# Altium project RK3576-SMC (021.0 A0).PrjPCB (part 1 of 3)
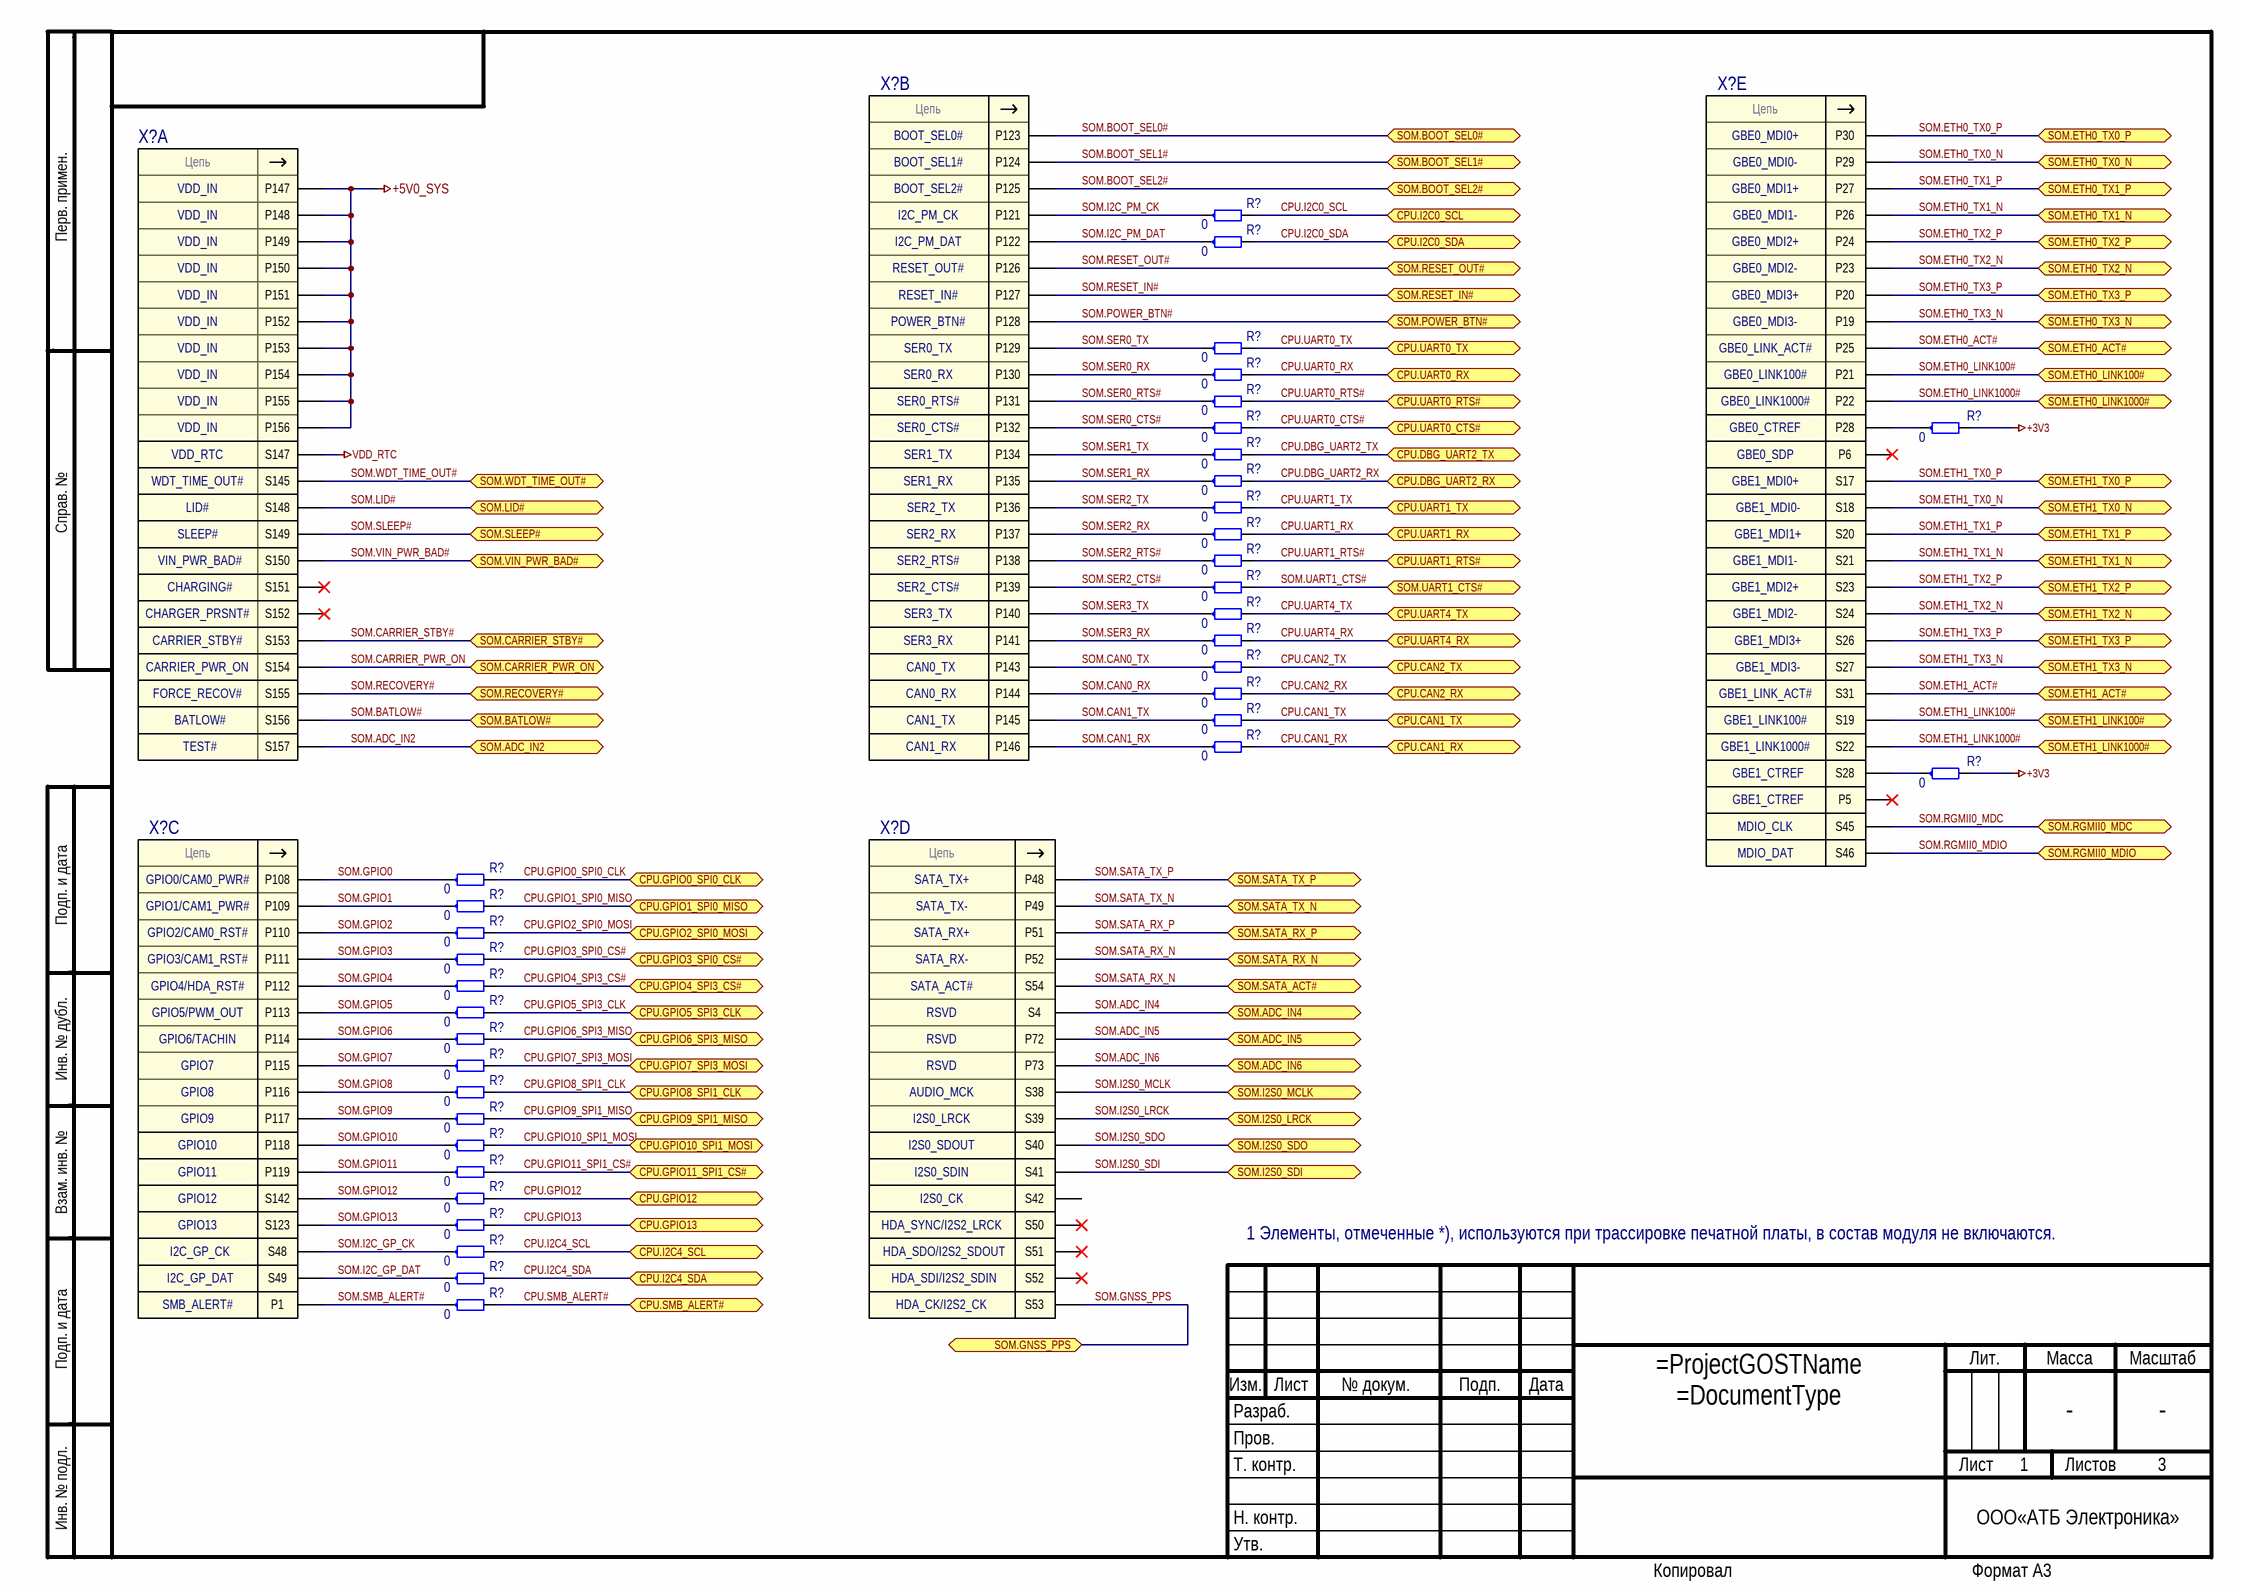
[diagram p0: RK3576-SMC.SMARC_1 (0021.0 A0).SchDoc]
ProjectGOSTOrganization: «АТБ Электроника»; ProjectGOSTPCBName: Плата печатная; ProjectGOSTPCBNumber: АНПБ.687264.019; ProjectGOSTPCBWeight: 30 г; ProjectRevisionCode: C1
7 sheets, 254 parts. Net scope: flat (ports and power ports of the same name join across sheets).
Board file: RK3576-SMC (0021.0 A0).PcbDoc
Sheets:
  RK3576-SMC.SMARC_1 (0021.0 A0).SchDoc
  RK3576-SMC.SMARC_2 (0021.0 A0).SchDoc
  RK3576-SMC.SMARC_3 (0021.0 A0).SchDoc
  RK3576-SMC.PMIC_BUCK (0021.0 A0).SchDoc
  RK3576-SMC.PMIC_LDO (0021.0 A0).SchDoc
  RK3576-SMC.LPDDR4 (0021.0 A0).SchDoc
  RK3576-SMC.EMMC (0021.0 A0).SchDoc

## Sheet RK3576-SMC.SMARC_1 (0021.0 A0).SchDoc
size 420 x 297 mm; SheetNumber: 1; SheetTotal: 3; Scale: -; DocumentType: Схема электрическая принципиальная; DocumentGOSTLIt1: ㅤ; DocumentGOSTLIt2: ㅤ; DocumentGOSTLIt3: ㅤ; DocumentTypeShort: Э3; DocumentGOSTNote: 1 Элементы, отмеченные *), используются при трассировке печатной платы, в состав модуля не включаются.; DocumentInvertoryNumber: ㅤ

### Parts
(Parts that share a designator on the sheet are numbered #1, #2 ... from top to bottom, then left to right.)
R?#1  0  [resc0603x26n]
R?#2  0  [resc0603x26n]
R?#3  0  [resc0603x26n]
R?#4  0  [resc0603x26n]
R?#5  0  [resc0603x26n]
R?#6  0  [resc0603x26n]
R?#7  0  [resc0603x26n]
R?#8  0  [resc0603x26n]
R?#9  0  [resc0603x26n]
R?#10  0  [resc0603x26n]
R?#11  0  [resc0603x26n]
R?#12  0  [resc0603x26n]
R?#13  0  [resc0603x26n]
R?#14  0  [resc0603x26n]
R?#15  0  [resc0603x26n]
R?#16  0  [resc0603x26n]
R?#17  0  [resc0603x26n]
R?#18  0  [resc0603x26n]
R?#19  0  [resc0603x26n]
R?#20  0  [resc0603x26n]
R?#21  0  [resc0603x26n]
R?#22  0  [resc0603x26n]
R?#23  0  [resc0603x26n]
R?#24  0  [resc0603x26n]
R?#25  0  [resc0603x26n]
R?#26  0  [resc0603x26n]
R?#27  0  [resc0603x26n]
R?#28  0  [resc0603x26n]
R?#29  0  [resc0603x26n]
R?#30  0  [resc0603x26n]
R?#31  0  [resc0603x26n]
R?#32  0  [resc0603x26n]
R?#33  0  [resc0603x26n]
R?#34  0  [resc0603x26n]
R?#35  0  [resc0603x26n]
R?#36  0  [resc0603x26n]
R?#37  0  [resc0603x26n]
X?#1  SMARC  [con_smarc]  (value not drawn)  (part B of 13)
X?#2  SMARC  [con_smarc]  (value not drawn)  (part E of 13)
X?#3  SMARC  [con_smarc]  (value not drawn)  (part A of 13)
X?#4  SMARC  [con_smarc]  (value not drawn)  (part C of 13)
X?#5  SMARC  [con_smarc]  (value not drawn)  (part D of 13)

### Ports
CPU.CAN1_RX (bidir), CPU.CAN1_TX (bidir), CPU.CAN2_RX (bidir), CPU.CAN2_TX (bidir), CPU.DBG_UART2_RX (bidir), CPU.DBG_UART2_TX (bidir), CPU.GPIO0_SPI0_CLK (bidir), CPU.GPIO1_SPI0_MISO (bidir), CPU.GPIO2_SPI0_MOSI (bidir), CPU.GPIO3_SPI0_CS# (bidir), CPU.GPIO4_SPI3_CS# (bidir), CPU.GPIO5_SPI3_CLK (bidir), CPU.GPIO6_SPI3_MISO (bidir), CPU.GPIO7_SPI3_MOSI (bidir), CPU.GPIO8_SPI1_CLK (bidir), CPU.GPIO9_SPI1_MISO (bidir), CPU.GPIO10_SPI1_MOSI (bidir), CPU.GPIO11_SPI1_CS# (bidir), CPU.GPIO12 (bidir), CPU.GPIO13 (bidir), CPU.I2C0_SCL (bidir), CPU.I2C0_SDA (bidir), CPU.I2C4_SCL (bidir), CPU.I2C4_SDA (bidir), CPU.SMB_ALERT# (bidir), CPU.UART0_CTS# (bidir), CPU.UART0_RTS# (bidir), CPU.UART0_RX (bidir), CPU.UART0_TX (bidir), CPU.UART1_RTS# (bidir), CPU.UART1_RX (bidir), CPU.UART1_TX (bidir), CPU.UART4_RX (bidir), CPU.UART4_TX (bidir), SOM.ADC_IN2 (bidir), SOM.ADC_IN4 (bidir), SOM.ADC_IN5 (bidir), SOM.ADC_IN6 (bidir), SOM.BATLOW# (bidir), SOM.BOOT_SEL0# (bidir), SOM.BOOT_SEL1# (bidir), SOM.BOOT_SEL2# (bidir), SOM.CARRIER_PWR_ON (bidir), SOM.CARRIER_STBY# (bidir), SOM.ETH0_ACT# (bidir), SOM.ETH0_LINK100# (bidir), SOM.ETH0_LINK1000# (bidir), SOM.ETH0_TX0_N (bidir), SOM.ETH0_TX0_P (bidir), SOM.ETH0_TX1_N (bidir), SOM.ETH0_TX1_P (bidir), SOM.ETH0_TX2_N (bidir), SOM.ETH0_TX2_P (bidir), SOM.ETH0_TX3_N (bidir), SOM.ETH0_TX3_P (bidir), SOM.ETH1_ACT# (bidir), SOM.ETH1_LINK100# (bidir), SOM.ETH1_LINK1000# (bidir), SOM.ETH1_TX0_N (bidir), SOM.ETH1_TX0_P (bidir), SOM.ETH1_TX1_N (bidir), SOM.ETH1_TX1_P (bidir), SOM.ETH1_TX2_N (bidir), SOM.ETH1_TX2_P (bidir), SOM.ETH1_TX3_N (bidir), SOM.ETH1_TX3_P (bidir), SOM.GNSS_PPS (bidir), SOM.I2S0_LRCK (bidir), SOM.I2S0_MCLK (bidir), SOM.I2S0_SDI (bidir), SOM.I2S0_SDO (bidir), SOM.LID# (bidir), SOM.POWER_BTN# (bidir), SOM.RECOVERY# (bidir), SOM.RESET_IN# (bidir), SOM.RESET_OUT# (bidir), SOM.RGMII0_MDC (bidir), SOM.RGMII0_MDIO (bidir), SOM.SATA_ACT# (bidir), SOM.SATA_RX_N (bidir), SOM.SATA_RX_P (bidir), SOM.SATA_TX_N (bidir), SOM.SATA_TX_P (bidir), SOM.SLEEP# (bidir), SOM.UART1_CTS# (bidir), SOM.VIN_PWR_BAD# (bidir), SOM.WDT_TIME_OUT# (bidir)

### Nets
+3V3: R?#7.2 R?#20.2
+5V0_SYS: X?#3.P147 X?#3.P148 X?#3.P149 X?#3.P150 X?#3.P151 X?#3.P152 X?#3.P153 X?#3.P154 X?#3.P155 X?#3.P156
VDD_RTC: X?#3.S147
CPU.CAN1_RX: R?#19.2 ; port CPU.CAN1_RX
CPU.CAN1_TX: R?#18.2 ; port CPU.CAN1_TX
CPU.CAN2_RX: R?#17.2 ; port CPU.CAN2_RX
CPU.CAN2_TX: R?#16.2 ; port CPU.CAN2_TX
CPU.DBG_UART2_RX: R?#9.2 ; port CPU.DBG_UART2_RX
CPU.DBG_UART2_TX: R?#8.2 ; port CPU.DBG_UART2_TX
CPU.GPIO0_SPI0_CLK: R?#21.2 ; port CPU.GPIO0_SPI0_CLK
CPU.GPIO1_SPI0_MISO: R?#22.2 ; port CPU.GPIO1_SPI0_MISO
CPU.GPIO2_SPI0_MOSI: R?#23.2 ; port CPU.GPIO2_SPI0_MOSI
CPU.GPIO3_SPI0_CS#: R?#24.2 ; port CPU.GPIO3_SPI0_CS#
CPU.GPIO4_SPI3_CS#: R?#25.2 ; port CPU.GPIO4_SPI3_CS#
CPU.GPIO5_SPI3_CLK: R?#26.2 ; port CPU.GPIO5_SPI3_CLK
CPU.GPIO6_SPI3_MISO: R?#27.2 ; port CPU.GPIO6_SPI3_MISO
CPU.GPIO7_SPI3_MOSI: R?#28.2 ; port CPU.GPIO7_SPI3_MOSI
CPU.GPIO8_SPI1_CLK: R?#29.2 ; port CPU.GPIO8_SPI1_CLK
CPU.GPIO9_SPI1_MISO: R?#30.2 ; port CPU.GPIO9_SPI1_MISO
CPU.GPIO10_SPI1_MOSI: R?#31.2 ; port CPU.GPIO10_SPI1_MOSI
CPU.GPIO11_SPI1_CS#: R?#32.2 ; port CPU.GPIO11_SPI1_CS#
CPU.GPIO12: R?#33.2 ; port CPU.GPIO12
CPU.GPIO13: R?#34.2 ; port CPU.GPIO13
CPU.I2C0_SCL: R?#1.2 ; port CPU.I2C0_SCL
CPU.I2C0_SDA: R?#2.2 ; port CPU.I2C0_SDA
CPU.I2C4_SCL: R?#35.2 ; port CPU.I2C4_SCL
CPU.I2C4_SDA: R?#36.2 ; port CPU.I2C4_SDA
CPU.SMB_ALERT#: R?#37.2 ; port CPU.SMB_ALERT#
CPU.UART0_CTS#: R?#6.2 ; port CPU.UART0_CTS#
CPU.UART0_RTS#: R?#5.2 ; port CPU.UART0_RTS#
CPU.UART0_RX: R?#4.2 ; port CPU.UART0_RX
CPU.UART0_TX: R?#3.2 ; port CPU.UART0_TX
CPU.UART1_RTS#: R?#12.2 ; port CPU.UART1_RTS#
CPU.UART1_RX: R?#11.2 ; port CPU.UART1_RX
CPU.UART1_TX: R?#10.2 ; port CPU.UART1_TX
CPU.UART4_RX: R?#15.2 ; port CPU.UART4_RX
CPU.UART4_TX: R?#14.2 ; port CPU.UART4_TX
SOM.ADC_IN2: X?#3.S157 ; port SOM.ADC_IN2
SOM.ADC_IN4: X?#5.S4 ; port SOM.ADC_IN4
SOM.ADC_IN5: X?#5.P72 ; port SOM.ADC_IN5
SOM.ADC_IN6: X?#5.P73 ; port SOM.ADC_IN6
SOM.BATLOW#: X?#3.S156 ; port SOM.BATLOW#
SOM.BOOT_SEL0#: X?#1.P123 ; port SOM.BOOT_SEL0#
SOM.BOOT_SEL1#: X?#1.P124 ; port SOM.BOOT_SEL1#
SOM.BOOT_SEL2#: X?#1.P125 ; port SOM.BOOT_SEL2#
SOM.CAN0_RX: R?#17.1 X?#1.P144
SOM.CAN0_TX: R?#16.1 X?#1.P143
SOM.CAN1_RX: R?#19.1 X?#1.P146
SOM.CAN1_TX: R?#18.1 X?#1.P145
SOM.CARRIER_PWR_ON: X?#3.S154 ; port SOM.CARRIER_PWR_ON
SOM.CARRIER_STBY#: X?#3.S153 ; port SOM.CARRIER_STBY#
SOM.ETH0_ACT#: X?#2.P25 ; port SOM.ETH0_ACT#
SOM.ETH0_LINK100#: X?#2.P21 ; port SOM.ETH0_LINK100#
SOM.ETH0_LINK1000#: X?#2.P22 ; port SOM.ETH0_LINK1000#
SOM.ETH0_TX0_N: X?#2.P29 ; port SOM.ETH0_TX0_N
SOM.ETH0_TX0_P: X?#2.P30 ; port SOM.ETH0_TX0_P
SOM.ETH0_TX1_N: X?#2.P26 ; port SOM.ETH0_TX1_N
SOM.ETH0_TX1_P: X?#2.P27 ; port SOM.ETH0_TX1_P
SOM.ETH0_TX2_N: X?#2.P23 ; port SOM.ETH0_TX2_N
SOM.ETH0_TX2_P: X?#2.P24 ; port SOM.ETH0_TX2_P
SOM.ETH0_TX3_N: X?#2.P19 ; port SOM.ETH0_TX3_N
SOM.ETH0_TX3_P: X?#2.P20 ; port SOM.ETH0_TX3_P
SOM.ETH1_ACT#: X?#2.S31 ; port SOM.ETH1_ACT#
SOM.ETH1_LINK100#: X?#2.S19 ; port SOM.ETH1_LINK100#
SOM.ETH1_LINK1000#: X?#2.S22 ; port SOM.ETH1_LINK1000#
SOM.ETH1_TX0_N: X?#2.S18 ; port SOM.ETH1_TX0_N
SOM.ETH1_TX0_P: X?#2.S17 ; port SOM.ETH1_TX0_P
SOM.ETH1_TX1_N: X?#2.S21 ; port SOM.ETH1_TX1_N
SOM.ETH1_TX1_P: X?#2.S20 ; port SOM.ETH1_TX1_P
SOM.ETH1_TX2_N: X?#2.S24 ; port SOM.ETH1_TX2_N
SOM.ETH1_TX2_P: X?#2.S23 ; port SOM.ETH1_TX2_P
SOM.ETH1_TX3_N: X?#2.S27 ; port SOM.ETH1_TX3_N
SOM.ETH1_TX3_P: X?#2.S26 ; port SOM.ETH1_TX3_P
SOM.GNSS_PPS: X?#5.S53 ; port SOM.GNSS_PPS
SOM.GPIO0: R?#21.1 X?#4.P108
SOM.GPIO1: R?#22.1 X?#4.P109
SOM.GPIO2: R?#23.1 X?#4.P110
SOM.GPIO3: R?#24.1 X?#4.P111
SOM.GPIO4: R?#25.1 X?#4.P112
SOM.GPIO5: R?#26.1 X?#4.P113
SOM.GPIO6: R?#27.1 X?#4.P114
SOM.GPIO7: R?#28.1 X?#4.P115
SOM.GPIO8: R?#29.1 X?#4.P116
SOM.GPIO9: R?#30.1 X?#4.P117
SOM.GPIO10: R?#31.1 X?#4.P118
SOM.GPIO11: R?#32.1 X?#4.P119
SOM.GPIO12: R?#33.1 X?#4.S142
SOM.GPIO13: R?#34.1 X?#4.S123
SOM.I2C_GP_CK: R?#35.1 X?#4.S48
SOM.I2C_GP_DAT: R?#36.1 X?#4.S49
SOM.I2C_PM_CK: R?#1.1 X?#1.P121
SOM.I2C_PM_DAT: R?#2.1 X?#1.P122
SOM.I2S0_LRCK: X?#5.S39 ; port SOM.I2S0_LRCK
SOM.I2S0_MCLK: X?#5.S38 ; port SOM.I2S0_MCLK
SOM.I2S0_SDI: X?#5.S41 ; port SOM.I2S0_SDI
SOM.I2S0_SDO: X?#5.S40 ; port SOM.I2S0_SDO
SOM.LID#: X?#3.S148 ; port SOM.LID#
SOM.POWER_BTN#: X?#1.P128 ; port SOM.POWER_BTN#
SOM.RECOVERY#: X?#3.S155 ; port SOM.RECOVERY#
SOM.RESET_IN#: X?#1.P127 ; port SOM.RESET_IN#
SOM.RESET_OUT#: X?#1.P126 ; port SOM.RESET_OUT#
SOM.RGMII0_MDC: X?#2.S45 ; port SOM.RGMII0_MDC
SOM.RGMII0_MDIO: X?#2.S46 ; port SOM.RGMII0_MDIO
SOM.SATA_RX_N: X?#5.P52 X?#5.S54 ; port SOM.SATA_RX_N, port SOM.SATA_ACT#
SOM.SATA_RX_P: X?#5.P51 ; port SOM.SATA_RX_P
SOM.SATA_TX_N: X?#5.P49 ; port SOM.SATA_TX_N
SOM.SATA_TX_P: X?#5.P48 ; port SOM.SATA_TX_P
SOM.SER0_CTS#: R?#6.1 X?#1.P132
SOM.SER0_RTS#: R?#5.1 X?#1.P131
SOM.SER0_RX: R?#4.1 X?#1.P130
SOM.SER0_TX: R?#3.1 X?#1.P129
SOM.SER1_RX: R?#9.1 X?#1.P135
SOM.SER1_TX: R?#8.1 X?#1.P134
SOM.SER2_CTS#: R?#13.1 X?#1.P139
SOM.SER2_RTS#: R?#12.1 X?#1.P138
SOM.SER2_RX: R?#11.1 X?#1.P137
SOM.SER2_TX: R?#10.1 X?#1.P136
SOM.SER3_RX: R?#15.1 X?#1.P141
SOM.SER3_TX: R?#14.1 X?#1.P140
SOM.SLEEP#: X?#3.S149 ; port SOM.SLEEP#
SOM.SMB_ALERT#: R?#37.1 X?#4.P1
SOM.UART1_CTS#: R?#13.2 ; port SOM.UART1_CTS#
SOM.VIN_PWR_BAD#: X?#3.S150 ; port SOM.VIN_PWR_BAD#
SOM.WDT_TIME_OUT#: X?#3.S145 ; port SOM.WDT_TIME_OUT#
NetR?#7_1: R?#7.1 X?#2.P28
NetR?#20_1: R?#20.1 X?#2.S28

Not connected (* = marked no-connect by the designer): X?#2 P5* P6*; X?#3 S151* S152*; X?#5 S42 S50* S51* S52*

### Notes on the sheet
- Перв. примен.
- Справ. №
- Подп. и дата
- Инв. № дубл.
- Взам. инв. №
- Разраб.
- Изм.
- Лист
- № докум.
- Подп.
- Дата
- Лит.
- Масса
- Масштаб
- Пров.
- Т. контр.
- -
- Листов
- Инв. № подл.
- Утв.
- Н. контр.
- Копировал
- Формат А3
- (in symbol SMARC, part A) Цепь; VDD_IN; VDD_RTC; WDT_TIME_OUT#; LID#; SLEEP#; VIN_PWR_BAD#; CHARGING#; CHARGER_PRSNT#; CARRIER_STBY#; CARRIER_PWR_ON; FORCE_RECOV#; BATLOW#; TEST#
- (in symbol SMARC, part B) Цепь; BOOT_SEL0#; BOOT_SEL1#; BOOT_SEL2#; I2C_PM_CK; I2C_PM_DAT; RESET_OUT#; RESET_IN#; POWER_BTN#; SER0_TX; SER0_RX; SER0_RTS#; SER0_CTS#; SER1_TX; SER1_RX; SER2_TX; SER2_RX; SER2_RTS#; SER2_CTS#; SER3_TX; SER3_RX; CAN0_TX; CAN0_RX; CAN1_TX; CAN1_RX
- (in symbol SMARC, part C) Цепь; GPIO0/CAM0_PWR#; GPIO1/CAM1_PWR#; GPIO2/CAM0_RST#; GPIO3/CAM1_RST#; GPIO4/HDA_RST#; GPIO5/PWM_OUT; GPIO6/TACHIN; GPIO7; GPIO8; GPIO9; GPIO10; GPIO11; GPIO12; GPIO13; I2C_GP_CK; I2C_GP_DAT; SMB_ALERT#
- (in symbol SMARC, part D) Цепь; SATA_TX+; SATA_TX-; SATA_RX+; SATA_RX-; SATA_ACT#; RSVD; AUDIO_MCK; I2S0_LRCK; I2S0_SDOUT; I2S0_SDIN; I2S0_CK; HDA_SYNC/I2S2_LRCK; HDA_SDO/I2S2_SDOUT; HDA_SDI/I2S2_SDIN; HDA_CK/I2S2_CK
- (in symbol SMARC, part E) Цепь; GBE0_MDI0+; GBE0_MDI0-; GBE0_MDI1+; GBE0_MDI1-; GBE0_MDI2+; GBE0_MDI2-; GBE0_MDI3+; GBE0_MDI3-; GBE0_LINK_ACT#; GBE0_LINK100#; GBE0_LINK1000#; GBE0_CTREF; GBE0_SDP; GBE1_MDI0+; GBE1_MDI0-; GBE1_MDI1+; GBE1_MDI1-; GBE1_MDI2+; GBE1_MDI2-; GBE1_MDI3+; GBE1_MDI3-; GBE1_LINK_ACT#; GBE1_LINK100#; GBE1_LINK1000#; GBE1_CTREF; MDIO_CLK; MDIO_DAT

### Library data of the parts
R?#1-R?#37 = RC0201JR-070RL: Резисторы (chip) общего назначения; Part_ID: ATB-09733; Manufacturer: Yageo; Schematic_Part: R_min_val,R_min,R_val,R; Наименование: 0201-0.05W-0±5%; Voltage: 30V; Power: 0.05; Точность: ±5%; Температура: -55 +125; Вариант установки: Поверхностный; Код ERP: E2-00008416; Photo: Photos\Photos\Yageo_RC0075-RC2512.jpg; Автор: Чепиков И.В.; Device: 0201-0.05W-0±5%_Yageo; Library Ref 2: R; Part Number: RC0201JR-070RL; Тип ЭКБ: Резисторы; Datasheet: Datasheets\Resistors\PYu-RC_Group_51_RoHS_L_12.pdf; Тип компонента: Резистор; Номинал: 0; Value: 0; Part_Number: RC0201JR-070RL; PCB_Footprint: resc0603x26n; Тип корпуса: Chip; Height: 0.26; Производитель: Yageo; Website: https://www.yageo.com/upload/media/product/products/datasheet/rchip/PYu-RC_Group_51_RoHS_L_12.pdf; Дата: 14.01.2025; NameFromManufacturer: RC0201JR-070RL; ComponentLink1URL: https://www.yageo.com/upload/media/product/products/datasheet/rchip/PYu-RC_Group_51_RoHS_L_12.pdf; ComponentLink1Description: PYu-RC_Group_51_RoHS_L_12.pdf; Original PN: RC0201JR-070RL
X?#1-X?#5 = SMARC: Краевой разъем SMARC_V21, 314 конт.; Part_ID: ATB-00378; Manufacturer: SMARC 2.1 Specification; Тип ЭКБ: Соединители; Тип компонента: Вилка Краевой Smarc; Photo: Photos\Photos\SMARC.jpg; Автор: Чепиков И.В.; Part Number: SMARC; Наименование: SMARC; Datasheet: Datasheets\Connectors\SMARC_V21-specification.pdf; Schematic_Part: SMARC_v2_1_XP; Value: SMARC; Part_Number: SMARC; PCB_Footprint: con_smarc; Website: https://www.isee.biz/images/Manuals/smarc/SMARC_Hardware_Specification_V211.pdf; Дата: 01.07.2024; Device: SMARC; NameFromManufacturer: SMARC; ComponentLink1URL: https://www.isee.biz/images/Manuals/smarc/SMARC_Hardware_Specification_V211.pdf; ComponentLink1Description: SMARC_V21-specification.pdf; Original PN: SMARC

## Sheet RK3576-SMC.SMARC_2 (0021.0 A0).SchDoc
size 420 x 297 mm; Scale: -; DocumentType: Схема электрическая принципиальная; DocumentGOSTLIt1: ㅤ; DocumentGOSTLIt2: ㅤ; DocumentGOSTLIt3: ㅤ; DocumentGOSTNote: Элементы, отмеченные *, используются при трассировке печатной платы, в состав модуля не включаются; SheetNumber: 2; SheetTotal: 6; DocumentTypeShort: Э3; DocumentInvertoryNumber: ㅤ
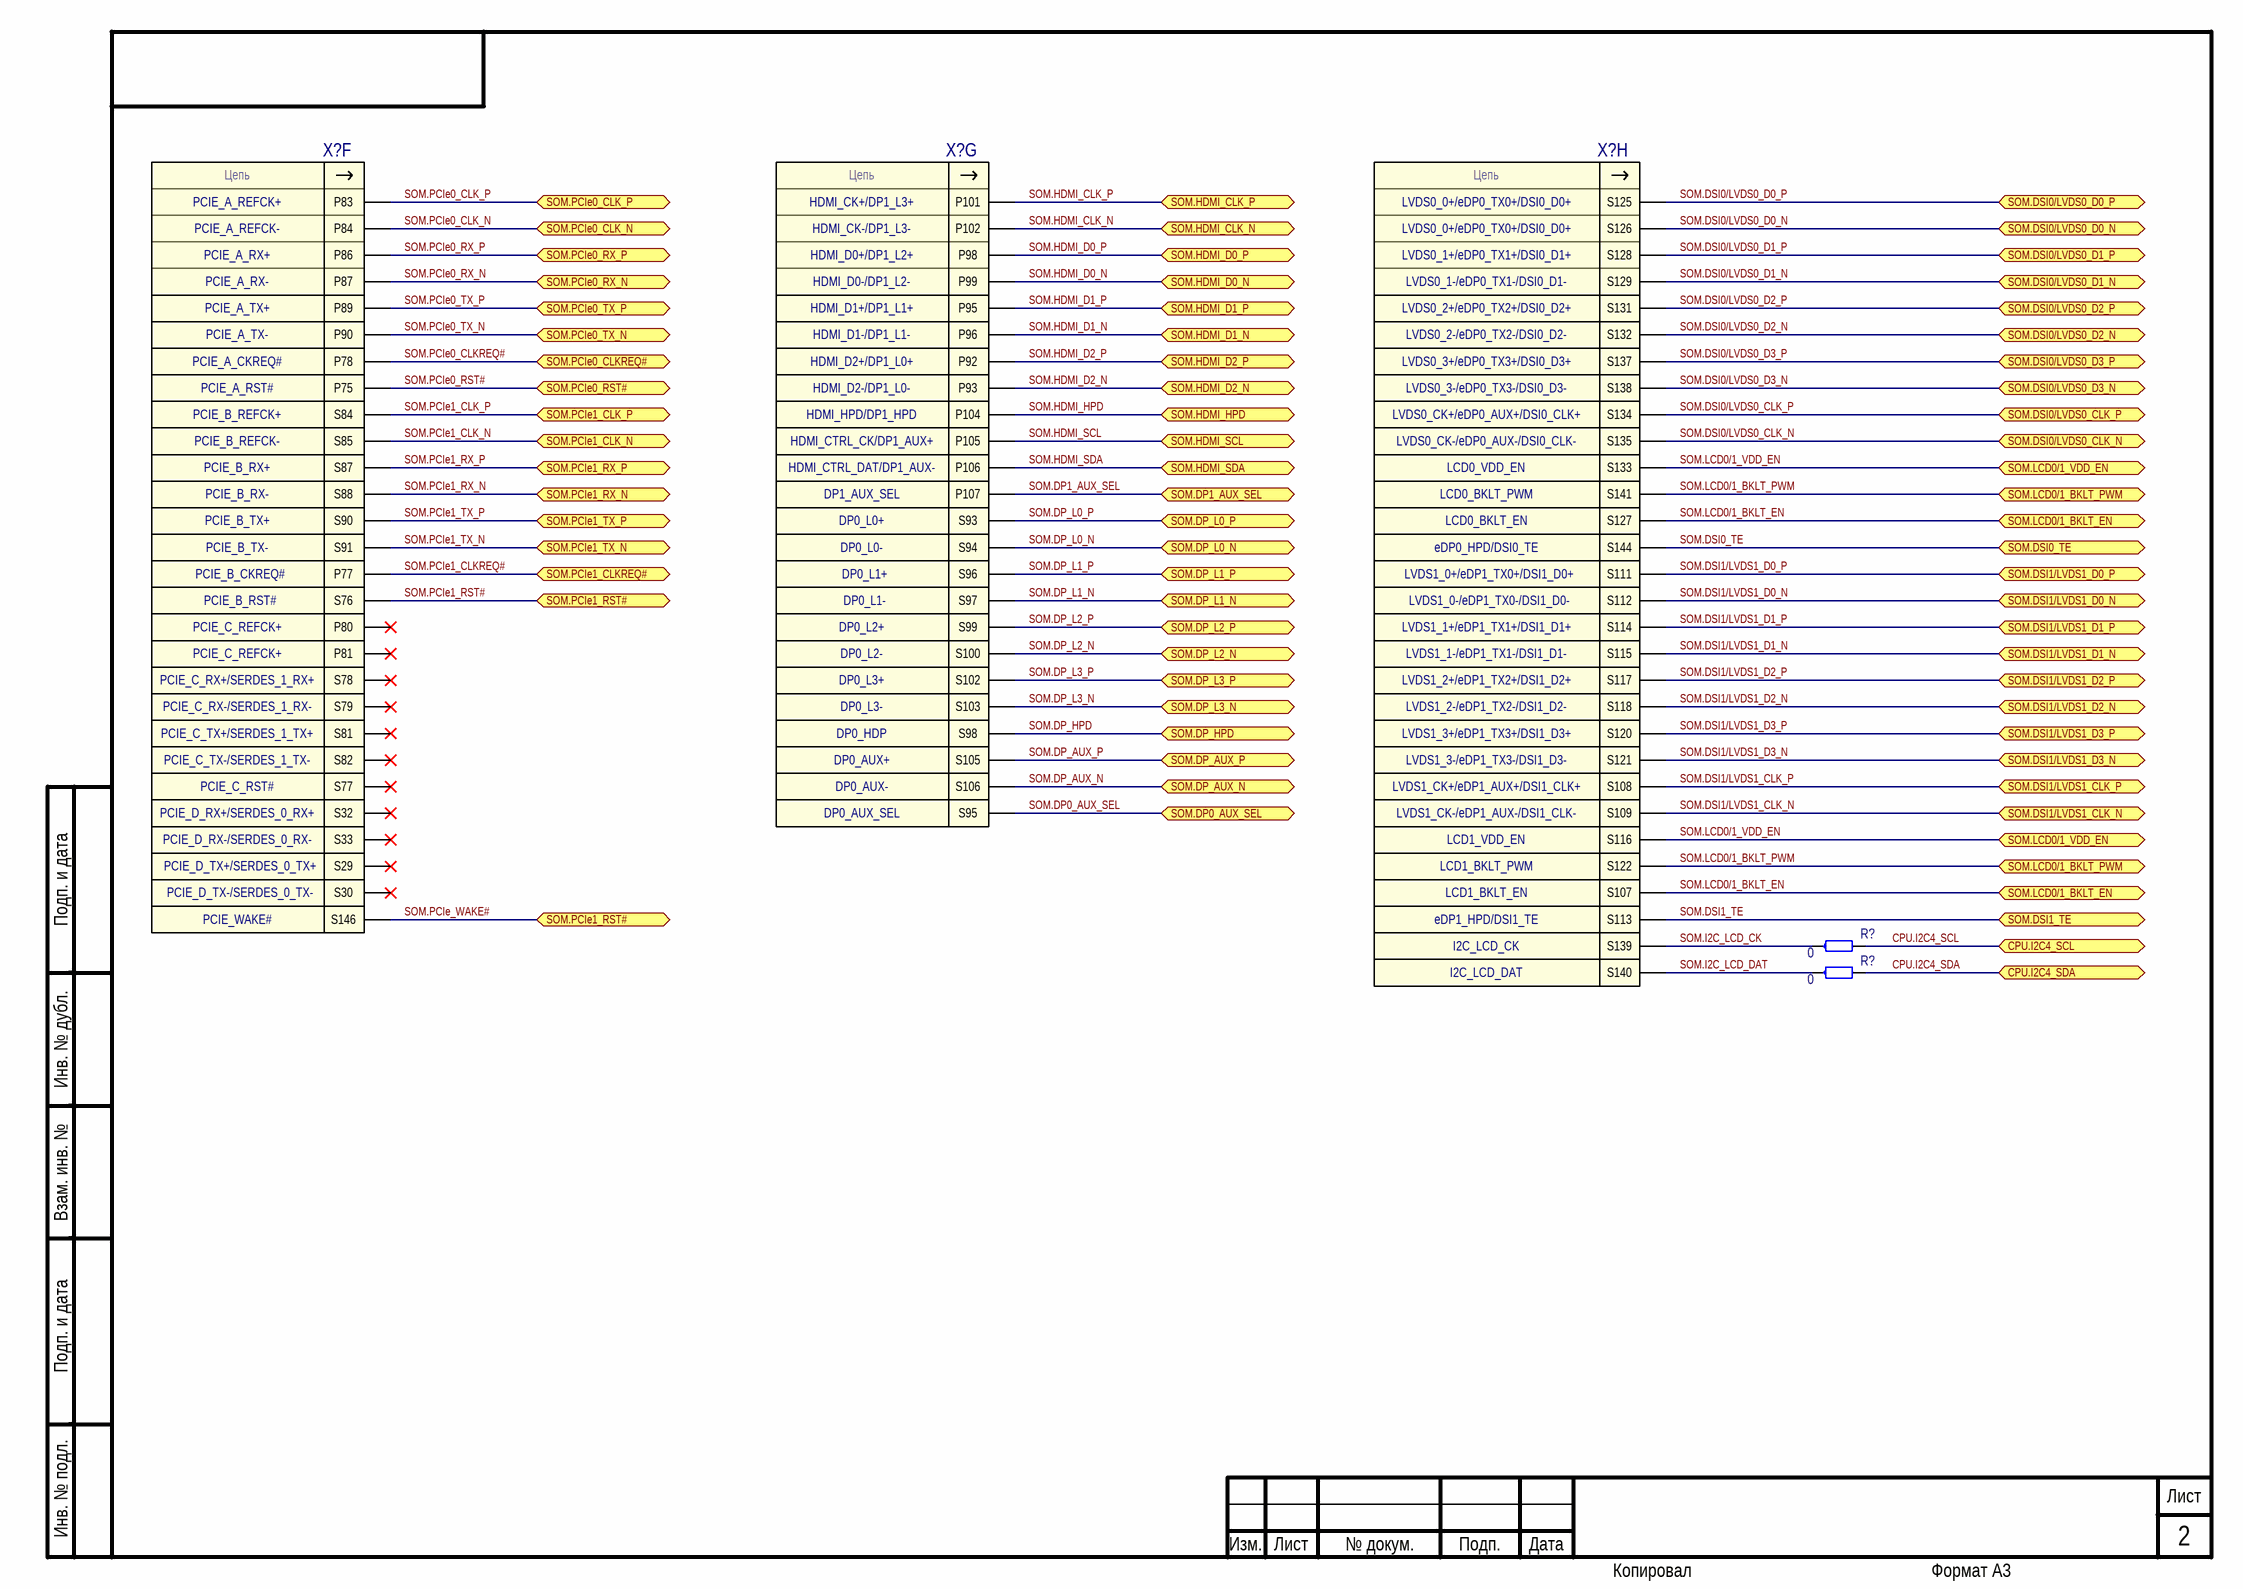
[diagram p1: RK3576-SMC.SMARC_2 (0021.0 A0).SchDoc]

### Parts
(Parts that share a designator on the sheet are numbered #1, #2 ... from top to bottom, then left to right.)
R?#38  0  [resc0603x26n]
R?#39  0  [resc0603x26n]
X?#6  SMARC  [con_smarc]  (value not drawn)  (part F of 13)
X?#7  SMARC  [con_smarc]  (value not drawn)  (part G of 13)
X?#8  SMARC  [con_smarc]  (value not drawn)  (part H of 13)

### Ports
CPU.I2C4_SCL (bidir), CPU.I2C4_SDA (bidir), SOM.DP0_AUX_SEL (bidir), SOM.DP1_AUX_SEL (bidir), SOM.DP_AUX_N (bidir), SOM.DP_AUX_P (bidir), SOM.DP_HPD (bidir), SOM.DP_L0_N (bidir), SOM.DP_L0_P (bidir), SOM.DP_L1_N (bidir), SOM.DP_L1_P (bidir), SOM.DP_L2_N (bidir), SOM.DP_L2_P (bidir), SOM.DP_L3_N (bidir), SOM.DP_L3_P (bidir), SOM.DSI0/LVDS0_CLK_N (bidir), SOM.DSI0/LVDS0_CLK_P (bidir), SOM.DSI0/LVDS0_D0_N (bidir), SOM.DSI0/LVDS0_D0_P (bidir), SOM.DSI0/LVDS0_D1_N (bidir), SOM.DSI0/LVDS0_D1_P (bidir), SOM.DSI0/LVDS0_D2_N (bidir), SOM.DSI0/LVDS0_D2_P (bidir), SOM.DSI0/LVDS0_D3_N (bidir), SOM.DSI0/LVDS0_D3_P (bidir), SOM.DSI0_TE (bidir), SOM.DSI1/LVDS1_CLK_N (bidir), SOM.DSI1/LVDS1_CLK_P (bidir), SOM.DSI1/LVDS1_D0_N (bidir), SOM.DSI1/LVDS1_D0_P (bidir), SOM.DSI1/LVDS1_D1_N (bidir), SOM.DSI1/LVDS1_D1_P (bidir), SOM.DSI1/LVDS1_D2_N (bidir), SOM.DSI1/LVDS1_D2_P (bidir), SOM.DSI1/LVDS1_D3_N (bidir), SOM.DSI1/LVDS1_D3_P (bidir), SOM.DSI1_TE (bidir), SOM.HDMI_CLK_N (bidir), SOM.HDMI_CLK_P (bidir), SOM.HDMI_D0_N (bidir), SOM.HDMI_D0_P (bidir), SOM.HDMI_D1_N (bidir), SOM.HDMI_D1_P (bidir), SOM.HDMI_D2_N (bidir), SOM.HDMI_D2_P (bidir), SOM.HDMI_HPD (bidir), SOM.HDMI_SCL (bidir), SOM.HDMI_SDA (bidir), SOM.LCD0/1_BKLT_EN (bidir), SOM.LCD0/1_BKLT_PWM (bidir), SOM.LCD0/1_VDD_EN (bidir), SOM.PCIe0_CLK_N (bidir), SOM.PCIe0_CLK_P (bidir), SOM.PCIe0_CLKREQ# (bidir), SOM.PCIe0_RST# (bidir), SOM.PCIe0_RX_N (bidir), SOM.PCIe0_RX_P (bidir), SOM.PCIe0_TX_N (bidir), SOM.PCIe0_TX_P (bidir), SOM.PCIe1_CLK_N (bidir), SOM.PCIe1_CLK_P (bidir), SOM.PCIe1_CLKREQ# (bidir), SOM.PCIe1_RST# (bidir), SOM.PCIe1_RX_N (bidir), SOM.PCIe1_RX_P (bidir), SOM.PCIe1_TX_N (bidir), SOM.PCIe1_TX_P (bidir)

### Nets
CPU.I2C4_SCL: R?#38.2 ; port CPU.I2C4_SCL
CPU.I2C4_SDA: R?#39.2 ; port CPU.I2C4_SDA
SOM.DP0_AUX_SEL: X?#7.S95 ; port SOM.DP0_AUX_SEL
SOM.DP1_AUX_SEL: X?#7.P107 ; port SOM.DP1_AUX_SEL
SOM.DP_AUX_N: X?#7.S106 ; port SOM.DP_AUX_N
SOM.DP_AUX_P: X?#7.S105 ; port SOM.DP_AUX_P
SOM.DP_HPD: X?#7.S98 ; port SOM.DP_HPD
SOM.DP_L0_N: X?#7.S94 ; port SOM.DP_L0_N
SOM.DP_L0_P: X?#7.S93 ; port SOM.DP_L0_P
SOM.DP_L1_N: X?#7.S97 ; port SOM.DP_L1_N
SOM.DP_L1_P: X?#7.S96 ; port SOM.DP_L1_P
SOM.DP_L2_N: X?#7.S100 ; port SOM.DP_L2_N
SOM.DP_L2_P: X?#7.S99 ; port SOM.DP_L2_P
SOM.DP_L3_N: X?#7.S103 ; port SOM.DP_L3_N
SOM.DP_L3_P: X?#7.S102 ; port SOM.DP_L3_P
SOM.DSI0/LVDS0_CLK_N: X?#8.S135 ; port SOM.DSI0/LVDS0_CLK_N
SOM.DSI0/LVDS0_CLK_P: X?#8.S134 ; port SOM.DSI0/LVDS0_CLK_P
SOM.DSI0/LVDS0_D0_N: X?#8.S126 ; port SOM.DSI0/LVDS0_D0_N
SOM.DSI0/LVDS0_D0_P: X?#8.S125 ; port SOM.DSI0/LVDS0_D0_P
SOM.DSI0/LVDS0_D1_N: X?#8.S129 ; port SOM.DSI0/LVDS0_D1_N
SOM.DSI0/LVDS0_D1_P: X?#8.S128 ; port SOM.DSI0/LVDS0_D1_P
SOM.DSI0/LVDS0_D2_N: X?#8.S132 ; port SOM.DSI0/LVDS0_D2_N
SOM.DSI0/LVDS0_D2_P: X?#8.S131 ; port SOM.DSI0/LVDS0_D2_P
SOM.DSI0/LVDS0_D3_N: X?#8.S138 ; port SOM.DSI0/LVDS0_D3_N
SOM.DSI0/LVDS0_D3_P: X?#8.S137 ; port SOM.DSI0/LVDS0_D3_P
SOM.DSI0_TE: X?#8.S144 ; port SOM.DSI0_TE
SOM.DSI1/LVDS1_CLK_N: X?#8.S109 ; port SOM.DSI1/LVDS1_CLK_N
SOM.DSI1/LVDS1_CLK_P: X?#8.S108 ; port SOM.DSI1/LVDS1_CLK_P
SOM.DSI1/LVDS1_D0_N: X?#8.S112 ; port SOM.DSI1/LVDS1_D0_N
SOM.DSI1/LVDS1_D0_P: X?#8.S111 ; port SOM.DSI1/LVDS1_D0_P
SOM.DSI1/LVDS1_D1_N: X?#8.S115 ; port SOM.DSI1/LVDS1_D1_N
SOM.DSI1/LVDS1_D1_P: X?#8.S114 ; port SOM.DSI1/LVDS1_D1_P
SOM.DSI1/LVDS1_D2_N: X?#8.S118 ; port SOM.DSI1/LVDS1_D2_N
SOM.DSI1/LVDS1_D2_P: X?#8.S117 ; port SOM.DSI1/LVDS1_D2_P
SOM.DSI1/LVDS1_D3_N: X?#8.S121 ; port SOM.DSI1/LVDS1_D3_N
SOM.DSI1/LVDS1_D3_P: X?#8.S120 ; port SOM.DSI1/LVDS1_D3_P
SOM.DSI1_TE: X?#8.S113 ; port SOM.DSI1_TE
SOM.HDMI_CLK_N: X?#7.P102 ; port SOM.HDMI_CLK_N
SOM.HDMI_CLK_P: X?#7.P101 ; port SOM.HDMI_CLK_P
SOM.HDMI_D0_N: X?#7.P99 ; port SOM.HDMI_D0_N
SOM.HDMI_D0_P: X?#7.P98 ; port SOM.HDMI_D0_P
SOM.HDMI_D1_N: X?#7.P96 ; port SOM.HDMI_D1_N
SOM.HDMI_D1_P: X?#7.P95 ; port SOM.HDMI_D1_P
SOM.HDMI_D2_N: X?#7.P93 ; port SOM.HDMI_D2_N
SOM.HDMI_D2_P: X?#7.P92 ; port SOM.HDMI_D2_P
SOM.HDMI_HPD: X?#7.P104 ; port SOM.HDMI_HPD
SOM.HDMI_SCL: X?#7.P105 ; port SOM.HDMI_SCL
SOM.HDMI_SDA: X?#7.P106 ; port SOM.HDMI_SDA
SOM.I2C_LCD_CK: R?#38.1 X?#8.S139
SOM.I2C_LCD_DAT: R?#39.1 X?#8.S140
SOM.LCD0/1_BKLT_EN: X?#8.S107 X?#8.S127 ; port SOM.LCD0/1_BKLT_EN
SOM.LCD0/1_BKLT_PWM: X?#8.S122 X?#8.S141 ; port SOM.LCD0/1_BKLT_PWM
SOM.LCD0/1_VDD_EN: X?#8.S116 X?#8.S133 ; port SOM.LCD0/1_VDD_EN
SOM.PCIe0_CLK_N: X?#6.P84 ; port SOM.PCIe0_CLK_N
SOM.PCIe0_CLK_P: X?#6.P83 ; port SOM.PCIe0_CLK_P
SOM.PCIe0_CLKREQ#: X?#6.P78 ; port SOM.PCIe0_CLKREQ#
SOM.PCIe0_RST#: X?#6.P75 ; port SOM.PCIe0_RST#
SOM.PCIe0_RX_N: X?#6.P87 ; port SOM.PCIe0_RX_N
SOM.PCIe0_RX_P: X?#6.P86 ; port SOM.PCIe0_RX_P
SOM.PCIe0_TX_N: X?#6.P90 ; port SOM.PCIe0_TX_N
SOM.PCIe0_TX_P: X?#6.P89 ; port SOM.PCIe0_TX_P
SOM.PCIe1_CLK_N: X?#6.S85 ; port SOM.PCIe1_CLK_N
SOM.PCIe1_CLK_P: X?#6.S84 ; port SOM.PCIe1_CLK_P
SOM.PCIe1_CLKREQ#: X?#6.P77 ; port SOM.PCIe1_CLKREQ#
SOM.PCIe1_RST#: X?#6.S76 X?#6.S146 ; port SOM.PCIe1_RST#  [also labelled SOM.PCIe_WAKE#]
SOM.PCIe1_RX_N: X?#6.S88 ; port SOM.PCIe1_RX_N
SOM.PCIe1_RX_P: X?#6.S87 ; port SOM.PCIe1_RX_P
SOM.PCIe1_TX_N: X?#6.S91 ; port SOM.PCIe1_TX_N
SOM.PCIe1_TX_P: X?#6.S90 ; port SOM.PCIe1_TX_P

Not connected (* = marked no-connect by the designer): X?#6 P80* P81* S29* S30* S32* S33* S77* S78* S79* S81* S82*

### Notes on the sheet
- Подп. и дата
- Инв. № дубл.
- Взам. инв. №
- Инв. № подл.
- Изм.
- Лист
- № докум.
- Подп.
- Дата
- Копировал
- Формат А3
- (in symbol SMARC, part F) Цепь; PCIE_A_REFCK+; PCIE_A_REFCK-; PCIE_A_RX+; PCIE_A_RX-; PCIE_A_TX+; PCIE_A_TX-; PCIE_A_CKREQ#; PCIE_A_RST#; PCIE_B_REFCK+; PCIE_B_REFCK-; PCIE_B_RX+; PCIE_B_RX-; PCIE_B_TX+; PCIE_B_TX-; PCIE_B_CKREQ#; PCIE_B_RST#; PCIE_C_REFCK+; PCIE_C_RX+/SERDES_1_RX+; PCIE_C_RX-/SERDES_1_RX-; PCIE_C_TX+/SERDES_1_TX+; PCIE_C_TX-/SERDES_1_TX-; PCIE_C_RST#; PCIE_D_RX+/SERDES_0_RX+; PCIE_D_RX-/SERDES_0_RX-; PCIE_D_TX+/SERDES_0_TX+; PCIE_D_TX-/SERDES_0_TX-; PCIE_WAKE#
- (in symbol SMARC, part G) Цепь; HDMI_CK+/DP1_L3+; HDMI_CK-/DP1_L3-; HDMI_D0+/DP1_L2+; HDMI_D0-/DP1_L2-; HDMI_D1+/DP1_L1+; HDMI_D1-/DP1_L1-; HDMI_D2+/DP1_L0+; HDMI_D2-/DP1_L0-; HDMI_HPD/DP1_HPD; HDMI_CTRL_CK/DP1_AUX+; HDMI_CTRL_DAT/DP1_AUX-; DP1_AUX_SEL; DP0_L0+; DP0_L0-; DP0_L1+; DP0_L1-; DP0_L2+; DP0_L2-; DP0_L3+; DP0_L3-; DP0_HDP; DP0_AUX+; DP0_AUX-; DP0_AUX_SEL
- (in symbol SMARC, part H) Цепь; LVDS0_0+/eDP0_TX0+/DSI0_D0+; LVDS0_1+/eDP0_TX1+/DSI0_D1+; LVDS0_1-/eDP0_TX1-/DSI0_D1-; LVDS0_2+/eDP0_TX2+/DSI0_D2+; LVDS0_2-/eDP0_TX2-/DSI0_D2-; LVDS0_3+/eDP0_TX3+/DSI0_D3+; LVDS0_3-/eDP0_TX3-/DSI0_D3-; LVDS0_CK+/eDP0_AUX+/DSI0_CLK+; LVDS0_CK-/eDP0_AUX-/DSI0_CLK-; LCD0_VDD_EN; LCD0_BKLT_PWM; LCD0_BKLT_EN; eDP0_HPD/DSI0_TE; LVDS1_0+/eDP1_TX0+/DSI1_D0+; LVDS1_0-/eDP1_TX0-/DSI1_D0-; LVDS1_1+/eDP1_TX1+/DSI1_D1+; LVDS1_1-/eDP1_TX1-/DSI1_D1-; LVDS1_2+/eDP1_TX2+/DSI1_D2+; LVDS1_2-/eDP1_TX2-/DSI1_D2-; LVDS1_3+/eDP1_TX3+/DSI1_D3+; LVDS1_3-/eDP1_TX3-/DSI1_D3-; LVDS1_CK+/eDP1_AUX+/DSI1_CLK+; LVDS1_CK-/eDP1_AUX-/DSI1_CLK-; LCD1_VDD_EN; LCD1_BKLT_PWM; LCD1_BKLT_EN; eDP1_HPD/DSI1_TE; I2C_LCD_CK; I2C_LCD_DAT

### Library data of the parts
R?#38 R?#39 = RC0201JR-070RL: as R?#1 on sheet RK3576-SMC.SMARC_1 (0021.0 A0); Part Number: RC0201JR-070RL; Тип ЭКБ: Резисторы; Datasheet: Datasheets\Resistors\PYu-RC_Group_51_RoHS_L_12.pdf; Тип компонента: Резистор; Номинал: 0; Value: 0; Part_Number: RC0201JR-070RL; PCB_Footprint: resc0603x26n; Тип корпуса: Chip; Height: 0.26; Производитель: Yageo; Website: https://www.yageo.com/upload/media/product/products/datasheet/rchip/PYu-RC_Group_51_RoHS_L_12.pdf; Дата: 14.01.2025; NameFromManufacturer: RC0201JR-070RL; ComponentLink1URL: https://www.yageo.com/upload/media/product/products/datasheet/rchip/PYu-RC_Group_51_RoHS_L_12.pdf; ComponentLink1Description: PYu-RC_Group_51_RoHS_L_12.pdf; Original PN: RC0201JR-070RL
X?#6-X?#8 = SMARC: Краевой разъем SMARC_V2.1, Smarc_v2.2, 314 конт.; Part_ID: ATB-00378; Manufacturer: SMARC 2.1 Specification; Schematic_Part: SMARC_v2_1_XP,SMARCV22XP; Тип ЭКБ: Соединители; Тип компонента: Вилка Краевой Smarc; Photo: Photos\Photos\SMARC.jpg; Автор: Чепиков И.В.; Library Ref 2: SMARCV22XP; Part Number: SMARC; Наименование: SMARC; Datasheet: Datasheets\Connectors\SMARC_V21-specification.pdf,SMARC_V22_Specification.pdf; Value: SMARC; Part_Number: SMARC; PCB_Footprint: con_smarc; Website: https://www.isee.biz/images/Manuals/smarc/SMARC_Hardware_Specification_V211.pdf; Дата: 01.07.2024; Device: SMARC; NameFromManufacturer: SMARC; ComponentLink1URL: https://www.isee.biz/images/Manuals/smarc/SMARC_Hardware_Specification_V211.pdf; ComponentLink1Description: SMARC_V21-specification.pdf,SMARC_V22_Specification.pdf; Original PN: SMARC

## Sheet RK3576-SMC.SMARC_3 (0021.0 A0).SchDoc
size 420 x 297 mm; Scale: -; DocumentType: Схема электрическая принципиальная; DocumentGOSTLIt1: ㅤ; DocumentGOSTLIt2: ㅤ; DocumentGOSTLIt3: ㅤ; DocumentGOSTNote: Элементы, отмеченные *, используются при трассировке печатной платы, в состав модуля не включаются; SheetNumber: 3; SheetTotal: 3; DocumentTypeShort: Э3; DocumentInvertoryNumber: ㅤ
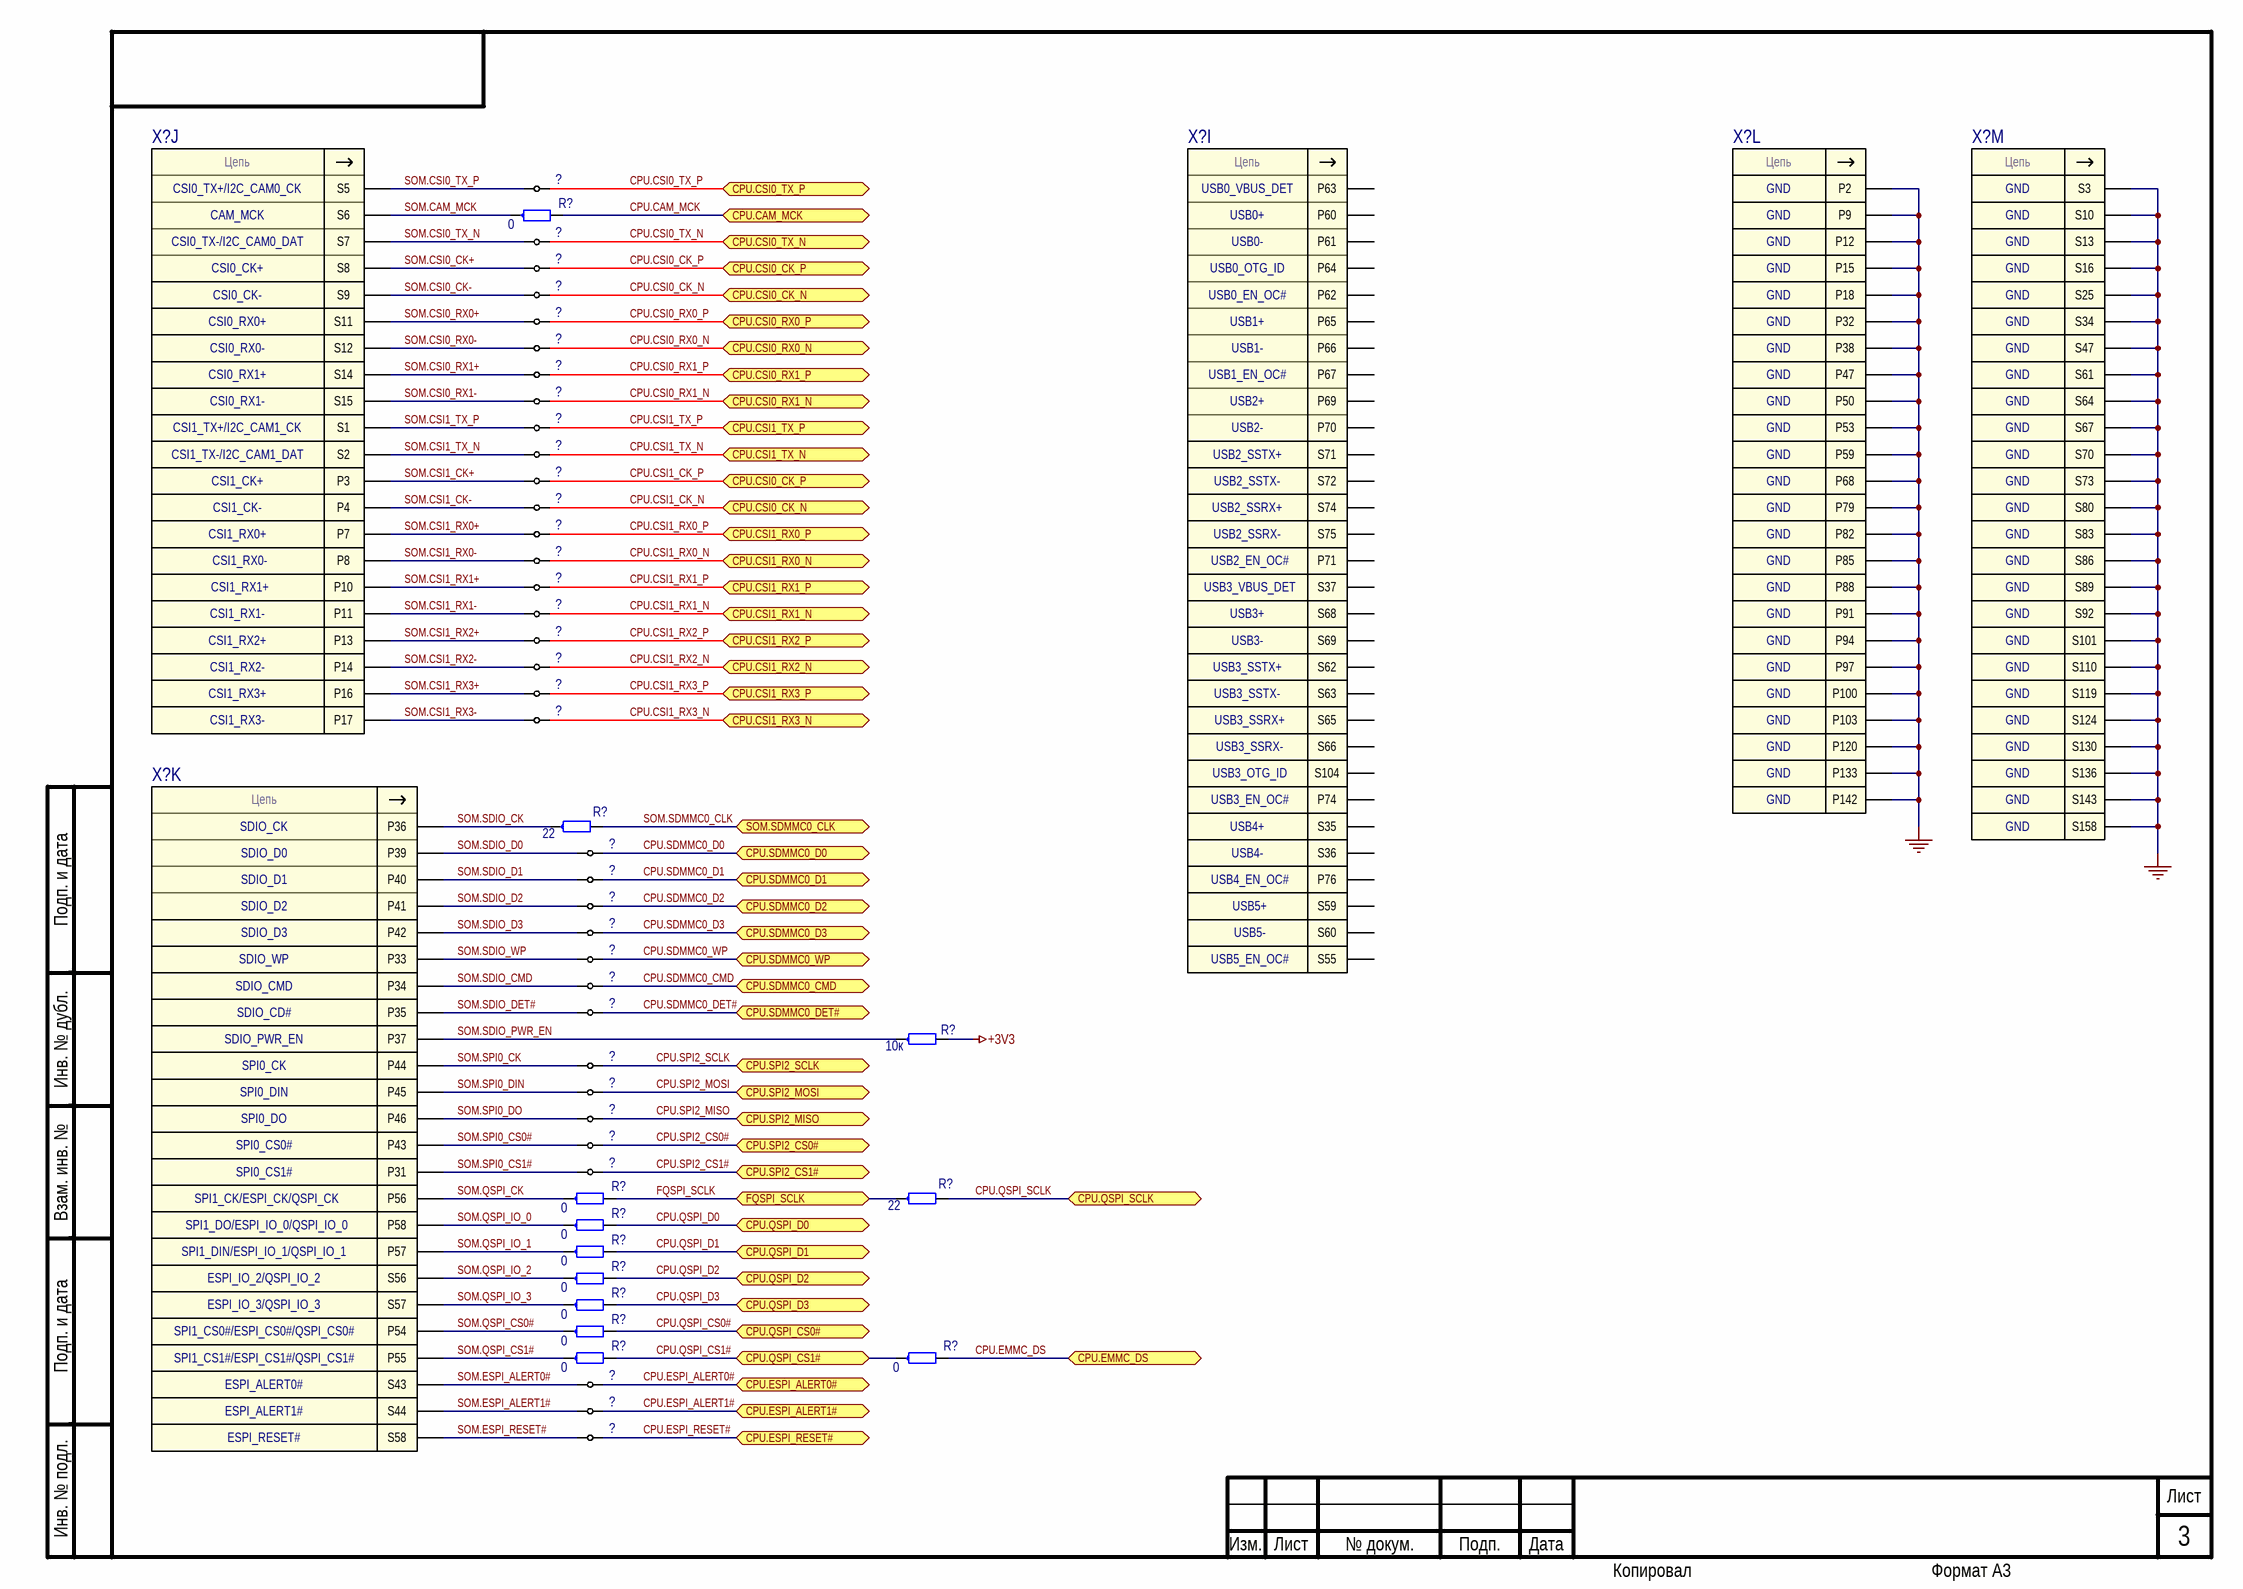
[diagram p2: RK3576-SMC.SMARC_3 (0021.0 A0).SchDoc]

### Parts
(Parts that share a designator on the sheet are numbered #1, #2 ... from top to bottom, then left to right.)
?#1  NetTie  [NetTie_0_6-1_25mm_close]  (value not drawn)  (net tie, no BOM)
?#2  NetTie  [NetTie_0_6-1_25mm_close]  (value not drawn)  (net tie, no BOM)
?#3  NetTie  [NetTie_0_6-1_25mm_close]  (value not drawn)  (net tie, no BOM)
?#4  NetTie  [NetTie_0_6-1_25mm_close]  (value not drawn)  (net tie, no BOM)
?#5  NetTie  [NetTie_0_6-1_25mm_close]  (value not drawn)  (net tie, no BOM)
?#6  NetTie  [NetTie_0_6-1_25mm_close]  (value not drawn)  (net tie, no BOM)
?#7  NetTie  [NetTie_0_6-1_25mm_close]  (value not drawn)  (net tie, no BOM)
?#8  NetTie  [NetTie_0_6-1_25mm_close]  (value not drawn)  (net tie, no BOM)
?#9  NetTie  [NetTie_0_6-1_25mm_close]  (value not drawn)  (net tie, no BOM)
?#10  NetTie  [NetTie_0_6-1_25mm_close]  (value not drawn)  (net tie, no BOM)
?#11  NetTie  [NetTie_0_6-1_25mm_close]  (value not drawn)  (net tie, no BOM)
?#12  NetTie  [NetTie_0_6-1_25mm_close]  (value not drawn)  (net tie, no BOM)
?#13  NetTie  [NetTie_0_6-1_25mm_close]  (value not drawn)  (net tie, no BOM)
?#14  NetTie  [NetTie_0_6-1_25mm_close]  (value not drawn)  (net tie, no BOM)
?#15  NetTie  [NetTie_0_6-1_25mm_close]  (value not drawn)  (net tie, no BOM)
?#16  NetTie  [NetTie_0_6-1_25mm_close]  (value not drawn)  (net tie, no BOM)
?#17  NetTie  [NetTie_0_6-1_25mm_close]  (value not drawn)  (net tie, no BOM)
?#18  NetTie  [NetTie_0_6-1_25mm_close]  (value not drawn)  (net tie, no BOM)
?#19  NetTie  [NetTie_0_6-1_25mm_close]  (value not drawn)  (net tie, no BOM)
?#20  NetTie  [NetTie_0_6-1_25mm_close]  (value not drawn)  (net tie, no BOM)
?#21  NetTie  [NetTie_0_6-1_25mm_close]  (value not drawn)  (net tie, no BOM)
?#22  NetTie  [NetTie_0_6-1_25mm_close]  (value not drawn)  (net tie, no BOM)
?#23  NetTie  [NetTie_0_6-1_25mm_close]  (value not drawn)  (net tie, no BOM)
?#24  NetTie  [NetTie_0_6-1_25mm_close]  (value not drawn)  (net tie, no BOM)
?#25  NetTie  [NetTie_0_6-1_25mm_close]  (value not drawn)  (net tie, no BOM)
?#26  NetTie  [NetTie_0_6-1_25mm_close]  (value not drawn)  (net tie, no BOM)
?#27  NetTie  [NetTie_0_6-1_25mm_close]  (value not drawn)  (net tie, no BOM)
?#28  NetTie  [NetTie_0_6-1_25mm_close]  (value not drawn)  (net tie, no BOM)
?#29  NetTie  [NetTie_0_6-1_25mm_close]  (value not drawn)  (net tie, no BOM)
?#30  NetTie  [NetTie_0_6-1_25mm_close]  (value not drawn)  (net tie, no BOM)
?#31  NetTie  [NetTie_0_6-1_25mm_close]  (value not drawn)  (net tie, no BOM)
?#32  NetTie  [NetTie_0_6-1_25mm_close]  (value not drawn)  (net tie, no BOM)
?#33  NetTie  [NetTie_0_6-1_25mm_close]  (value not drawn)  (net tie, no BOM)
?#34  NetTie  [NetTie_0_6-1_25mm_close]  (value not drawn)  (net tie, no BOM)
?#35  NetTie  [NetTie_0_6-1_25mm_close]  (value not drawn)  (net tie, no BOM)
R?#40  0  [resc0603x26n]
R?#41  22  [resc0603x26n]
R?#42  10к  [resc5025x65n]
R?#43  0  [resc0603x26n]
R?#44  22  [resc0603x26n]
R?#45  0  [resc0603x26n]
R?#46  0  [resc0603x26n]
R?#47  0  [resc0603x26n]
R?#48  0  [resc0603x26n]
R?#49  0  [resc0603x26n]
R?#50  0  [resc0603x26n]
R?#51  0  [resc0603x26n]
X?#9  SMARC  [con_smarc]  (value not drawn)  (part J of 13)
X?#10  SMARC  [con_smarc]  (value not drawn)  (part I of 13)
X?#11  SMARC  [con_smarc]  (value not drawn)  (part L of 13)
X?#12  SMARC  [con_smarc]  (value not drawn)  (part M of 13)
X?#13  SMARC  [con_smarc]  (value not drawn)  (part K of 13)

### Ports
CPU.CAM_MCK (bidir), CPU.CSI0_CK_N (bidir), CPU.CSI0_CK_P (bidir), CPU.CSI0_RX0_N (bidir), CPU.CSI0_RX0_P (bidir), CPU.CSI0_RX1_N (bidir), CPU.CSI0_RX1_P (bidir), CPU.CSI0_TX_N (bidir), CPU.CSI0_TX_P (bidir), CPU.CSI1_RX0_N (bidir), CPU.CSI1_RX0_P (bidir), CPU.CSI1_RX1_N (bidir), CPU.CSI1_RX1_P (bidir), CPU.CSI1_RX2_N (bidir), CPU.CSI1_RX2_P (bidir), CPU.CSI1_RX3_N (bidir), CPU.CSI1_RX3_P (bidir), CPU.CSI1_TX_N (bidir), CPU.CSI1_TX_P (bidir), CPU.EMMC_DS (bidir), CPU.ESPI_ALERT0# (bidir), CPU.ESPI_ALERT1# (bidir), CPU.ESPI_RESET# (bidir), CPU.QSPI_CS0# (bidir), CPU.QSPI_CS1# (bidir), CPU.QSPI_D0 (bidir), CPU.QSPI_D1 (bidir), CPU.QSPI_D2 (bidir), CPU.QSPI_D3 (bidir), CPU.QSPI_SCLK (bidir), CPU.SDMMC0_CMD (bidir), CPU.SDMMC0_D0 (bidir), CPU.SDMMC0_D1 (bidir), CPU.SDMMC0_D2 (bidir), CPU.SDMMC0_D3 (bidir), CPU.SDMMC0_DET# (bidir), CPU.SDMMC0_WP (bidir), CPU.SPI2_CS0# (bidir), CPU.SPI2_CS1# (bidir), CPU.SPI2_MISO (bidir), CPU.SPI2_MOSI (bidir), CPU.SPI2_SCLK (bidir), FQSPI_SCLK (bidir), SOM.SDMMC0_CLK (bidir)

### Nets
+3V3: R?#42.2
SOM.GND: X?#11.P2 X?#11.P9 X?#11.P12 X?#11.P15 X?#11.P18 X?#11.P32 X?#11.P38 X?#11.P47 X?#11.P50 X?#11.P53 X?#11.P59 X?#11.P68 X?#11.P79 X?#11.P82 X?#11.P85 X?#11.P88 X?#11.P91 X?#11.P94 X?#11.P97 X?#11.P100 X?#11.P103 X?#11.P120 X?#11.P133 X?#11.P142 X?#12.S3 X?#12.S10 X?#12.S13 X?#12.S16 X?#12.S25 X?#12.S34 X?#12.S47 X?#12.S61 X?#12.S64 X?#12.S67 X?#12.S70 X?#12.S73 X?#12.S80 X?#12.S83 X?#12.S86 X?#12.S89 X?#12.S92 X?#12.S101 X?#12.S110 X?#12.S119 X?#12.S124 X?#12.S130 X?#12.S136 X?#12.S143 X?#12.S158
CPU.CAM_MCK: R?#40.2 ; port CPU.CAM_MCK
CPU.CSI0_CK_N: ?#4.2 ?#12.2 ; port CPU.CSI0_CK_N  [also labelled CPU.CSI1_CK_N]
CPU.CSI0_CK_P: ?#3.2 ?#11.2 ; port CPU.CSI0_CK_P  [also labelled CPU.CSI1_CK_P]
CPU.CSI0_RX0_N: ?#6.2 ; port CPU.CSI0_RX0_N
CPU.CSI0_RX0_P: ?#5.2 ; port CPU.CSI0_RX0_P
CPU.CSI0_RX1_N: ?#8.2 ; port CPU.CSI0_RX1_N
CPU.CSI0_RX1_P: ?#7.2 ; port CPU.CSI0_RX1_P
CPU.CSI0_TX_N: ?#2.2 ; port CPU.CSI0_TX_N
CPU.CSI0_TX_P: ?#1.2 ; port CPU.CSI0_TX_P
CPU.CSI1_RX0_N: ?#14.2 ; port CPU.CSI1_RX0_N
CPU.CSI1_RX0_P: ?#13.2 ; port CPU.CSI1_RX0_P
CPU.CSI1_RX1_N: ?#16.2 ; port CPU.CSI1_RX1_N
CPU.CSI1_RX1_P: ?#15.2 ; port CPU.CSI1_RX1_P
CPU.CSI1_RX2_N: ?#18.2 ; port CPU.CSI1_RX2_N
CPU.CSI1_RX2_P: ?#17.2 ; port CPU.CSI1_RX2_P
CPU.CSI1_RX3_N: ?#20.2 ; port CPU.CSI1_RX3_N
CPU.CSI1_RX3_P: ?#19.2 ; port CPU.CSI1_RX3_P
CPU.CSI1_TX_N: ?#10.2 ; port CPU.CSI1_TX_N
CPU.CSI1_TX_P: ?#9.2 ; port CPU.CSI1_TX_P
CPU.EMMC_DS: R?#51.2 ; port CPU.EMMC_DS
CPU.ESPI_ALERT0#: ?#33.2 ; port CPU.ESPI_ALERT0#
CPU.ESPI_ALERT1#: ?#34.2 ; port CPU.ESPI_ALERT1#
CPU.ESPI_RESET#: ?#35.2 ; port CPU.ESPI_RESET#
CPU.QSPI_CS0#: R?#49.2 ; port CPU.QSPI_CS0#
CPU.QSPI_CS1#: R?#50.2 R?#51.1 ; port CPU.QSPI_CS1#
CPU.QSPI_D0: R?#45.2 ; port CPU.QSPI_D0
CPU.QSPI_D1: R?#46.2 ; port CPU.QSPI_D1
CPU.QSPI_D2: R?#47.2 ; port CPU.QSPI_D2
CPU.QSPI_D3: R?#48.2 ; port CPU.QSPI_D3
CPU.QSPI_SCLK: R?#44.2 ; port CPU.QSPI_SCLK
CPU.SDMMC0_CMD: ?#26.2 ; port CPU.SDMMC0_CMD
CPU.SDMMC0_D0: ?#21.2 ; port CPU.SDMMC0_D0
CPU.SDMMC0_D1: ?#22.2 ; port CPU.SDMMC0_D1
CPU.SDMMC0_D2: ?#23.2 ; port CPU.SDMMC0_D2
CPU.SDMMC0_D3: ?#24.2 ; port CPU.SDMMC0_D3
CPU.SDMMC0_DET#: ?#27.2 ; port CPU.SDMMC0_DET#
CPU.SDMMC0_WP: ?#25.2 ; port CPU.SDMMC0_WP
CPU.SPI2_CS0#: ?#31.2 ; port CPU.SPI2_CS0#
CPU.SPI2_CS1#: ?#32.2 ; port CPU.SPI2_CS1#
CPU.SPI2_MISO: ?#30.2 ; port CPU.SPI2_MISO
CPU.SPI2_MOSI: ?#29.2 ; port CPU.SPI2_MOSI
CPU.SPI2_SCLK: ?#28.2 ; port CPU.SPI2_SCLK
FQSPI_SCLK: R?#43.2 R?#44.1 ; port FQSPI_SCLK
SOM.CAM_MCK: R?#40.1 X?#9.S6
SOM.CSI0_CK+: ?#3.1 X?#9.S8
SOM.CSI0_CK-: ?#4.1 X?#9.S9
SOM.CSI0_RX0+: ?#5.1 X?#9.S11
SOM.CSI0_RX0-: ?#6.1 X?#9.S12
SOM.CSI0_RX1+: ?#7.1 X?#9.S14
SOM.CSI0_RX1-: ?#8.1 X?#9.S15
SOM.CSI0_TX_N: ?#2.1 X?#9.S7
SOM.CSI0_TX_P: ?#1.1 X?#9.S5
SOM.CSI1_CK+: ?#11.1 X?#9.P3
SOM.CSI1_CK-: ?#12.1 X?#9.P4
SOM.CSI1_RX0+: ?#13.1 X?#9.P7
SOM.CSI1_RX0-: ?#14.1 X?#9.P8
SOM.CSI1_RX1+: ?#15.1 X?#9.P10
SOM.CSI1_RX1-: ?#16.1 X?#9.P11
SOM.CSI1_RX2+: ?#17.1 X?#9.P13
SOM.CSI1_RX2-: ?#18.1 X?#9.P14
SOM.CSI1_RX3+: ?#19.1 X?#9.P16
SOM.CSI1_RX3-: ?#20.1 X?#9.P17
SOM.CSI1_TX_N: ?#10.1 X?#9.S2
SOM.CSI1_TX_P: ?#9.1 X?#9.S1
SOM.ESPI_ALERT0#: ?#33.1 X?#13.S43
SOM.ESPI_ALERT1#: ?#34.1 X?#13.S44
SOM.ESPI_RESET#: ?#35.1 X?#13.S58
SOM.QSPI_CK: R?#43.1 X?#13.P56
SOM.QSPI_CS0#: R?#49.1 X?#13.P54
SOM.QSPI_CS1#: R?#50.1 X?#13.P55
SOM.QSPI_IO_0: R?#45.1 X?#13.P58
SOM.QSPI_IO_1: R?#46.1 X?#13.P57
SOM.QSPI_IO_2: R?#47.1 X?#13.S56
SOM.QSPI_IO_3: R?#48.1 X?#13.S57
SOM.SDIO_CK: R?#41.1 X?#13.P36
SOM.SDIO_CMD: ?#26.1 X?#13.P34
SOM.SDIO_D0: ?#21.1 X?#13.P39
SOM.SDIO_D1: ?#22.1 X?#13.P40
SOM.SDIO_D2: ?#23.1 X?#13.P41
SOM.SDIO_D3: ?#24.1 X?#13.P42
SOM.SDIO_DET#: ?#27.1 X?#13.P35
SOM.SDIO_PWR_EN: R?#42.1 X?#13.P37
SOM.SDIO_WP: ?#25.1 X?#13.P33
SOM.SDMMC0_CLK: R?#41.2 ; port SOM.SDMMC0_CLK
SOM.SPI0_CK: ?#28.1 X?#13.P44
SOM.SPI0_CS0#: ?#31.1 X?#13.P43
SOM.SPI0_CS1#: ?#32.1 X?#13.P31
SOM.SPI0_DIN: ?#29.1 X?#13.P45
SOM.SPI0_DO: ?#30.1 X?#13.P46

Not connected (* = marked no-connect by the designer): X?#10 P60 P61 P62 P63 P64 P65 P66 P67 P69 P70 P71 P74 P76 S35 S36 S37 S55 S59 S60 S62 S63 S65 S66 S68 S69 S71 S72 S74 S75 S104

### Notes on the sheet
- Подп. и дата
- Инв. № дубл.
- Взам. инв. №
- Инв. № подл.
- Изм.
- Лист
- № докум.
- Подп.
- Дата
- Копировал
- Формат А3
- (in symbol SMARC, part I) Цепь; USB0_VBUS_DET; USB0+; USB0-; USB0_OTG_ID; USB0_EN_OC#; USB1+; USB1-; USB1_EN_OC#; USB2+; USB2-; USB2_SSTX+; USB2_SSTX-; USB2_SSRX+; USB2_SSRX-; USB2_EN_OC#; USB3_VBUS_DET; USB3+; USB3-; USB3_SSTX+; USB3_SSTX-; USB3_SSRX+; USB3_SSRX-; USB3_OTG_ID; USB3_EN_OC#; USB4+; USB4-; USB4_EN_OC#; USB5+; USB5-; USB5_EN_OC#
- (in symbol SMARC, part J) Цепь; CSI0_TX+/I2C_CAM0_CK; CAM_MCK; CSI0_TX-/I2C_CAM0_DAT; CSI0_CK+; CSI0_CK-; CSI0_RX0+; CSI0_RX0-; CSI0_RX1+; CSI0_RX1-; CSI1_TX+/I2C_CAM1_CK; CSI1_TX-/I2C_CAM1_DAT; CSI1_CK+; CSI1_CK-; CSI1_RX0+; CSI1_RX0-; CSI1_RX1+; CSI1_RX1-; CSI1_RX2+; CSI1_RX2-; CSI1_RX3+; CSI1_RX3-
- (in symbol SMARC, part K) Цепь; SDIO_CK; SDIO_D0; SDIO_D1; SDIO_D2; SDIO_D3; SDIO_WP; SDIO_CMD; SDIO_CD#; SDIO_PWR_EN; SPI0_CK; SPI0_DIN; SPI0_DO; SPI0_CS0#; SPI0_CS1#; SPI1_CK/ESPI_CK/QSPI_CK; SPI1_DO/ESPI_IO_0/QSPI_IO_0; SPI1_DIN/ESPI_IO_1/QSPI_IO_1; ESPI_IO_2/QSPI_IO_2; ESPI_IO_3/QSPI_IO_3; SPI1_CS0#/ESPI_CS0#/QSPI_CS0#; SPI1_CS1#/ESPI_CS1#/QSPI_CS1#; ESPI_ALERT0#; ESPI_ALERT1#; ESPI_RESET#
- (in symbol SMARC, part L) Цепь; GND
- (in symbol SMARC, part M) Цепь; GND

### Library data of the parts
?#1-?#35 = NetTie_0.6-1.25_Close: Part_ID: ATB-00257; Rule: UNIONINDEX=0|RULEKIND=Clearance|NETSCOPE=DifferentNets|LAYERKIND=SameLayer|NAME=Schematic Clearance Constraint|GAP=0mil|GENERICCLEARANCE=0mil|IGNOREPADTOPADCLEARANCEINFOOTPRINT=TRUE|OBJECTCLEARANCES= |UNIT=Metric; Rule: UNIONINDEX=0|RULEKIND=PolygonConnect|NETSCOPE=AnyNet|LAYERKIND=SameLayer|NAME=Schematic Polygon Connect Style|CONNECTSTYLE=Direct|RELIEFCONDUCTORWIDTH=10mil|RELIEFENTRIES=4|POLYGONRELIEFANGLE=45 Angle|AIRGAPWIDTH=10mil|UNIT=Metric; Rule: UNIONINDEX=0|RULEKIND=ShortCircuit|NETSCOPE=AnyNet|LAYERKIND=SameLayer|NAME=Schematic Short-Circuit Constraint|ALLOWED=TRUE|UNIT=Metric; Тип ЭКБ: Элементы; Тип компонента: Перемычка; Автор: Чепиков И.В.; Part Number: NetTie_0.6-1.25_Close; Наименование: NetTie_0.6-1.25_Close; Value: -; Part_Number: NetTie_0.6-1.25_Close; Дата: 11.11.2024; Device: NetTie_0.6-1.25_Close; NameFromManufacturer: NetTie_0.6-1.25_Close
R?#40 R?#43 R?#45-R?#51 = RC0201JR-070RL: as R?#1 on sheet RK3576-SMC.SMARC_1 (0021.0 A0); Part Number: RC0201JR-070RL; Тип ЭКБ: Резисторы; Datasheet: Datasheets\Resistors\PYu-RC_Group_51_RoHS_L_12.pdf; Тип компонента: Резистор; Номинал: 0; Value: 0; Part_Number: RC0201JR-070RL; PCB_Footprint: resc0603x26n; Тип корпуса: Chip; Height: 0.26; Производитель: Yageo; Website: https://www.yageo.com/upload/media/product/products/datasheet/rchip/PYu-RC_Group_51_RoHS_L_12.pdf; Дата: 14.01.2025; NameFromManufacturer: RC0201JR-070RL; ComponentLink1URL: https://www.yageo.com/upload/media/product/products/datasheet/rchip/PYu-RC_Group_51_RoHS_L_12.pdf; ComponentLink1Description: PYu-RC_Group_51_RoHS_L_12.pdf; Original PN: RC0201JR-070RL
R?#41 R?#44 = RC0201FR-0722RL: Резисторы (chip) общего назначения; Part_ID: ATB-09726; Manufacturer: Yageo; Schematic_Part: R_min_val,R_min,R_val,R; Наименование: 0201-0.05W-22-200ppm±1%; Voltage: 30V; Power: 0.05; Точность: ±1%; ТКС (от  -60 до +20 град): ± 200; Ряд: E24; Температура: -55 +125; Вариант установки: Поверхностный; Код ERP: E2-00006876; Photo: Photos\Photos\Yageo_RC0075-RC2512.jpg; Автор: Чепиков И.В.; Device: 0201-0.05W-22-200ppm±1%_Yageo; Library Ref 2: R; Part Number: RC0201FR-0722RL; Тип ЭКБ: Резисторы; Datasheet: Datasheets\Resistors\PYu-RC_Group_51_RoHS_L_12.pdf; Тип компонента: Резистор; Номинал: 22; Value: 22; ТКС (от +20 град до max): ± 200; Part_Number: RC0201FR-0722RL; PCB_Footprint: resc0603x26n; Тип корпуса: Chip; Height: 0.26; Производитель: Yageo; Website: https://www.yageo.com/upload/media/product/products/datasheet/rchip/PYu-RC_Group_51_RoHS_L_12.pdf; Дата: 13.01.2025; NameFromManufacturer: RC0201FR-0722RL; ComponentLink1URL: https://www.yageo.com/upload/media/product/products/datasheet/rchip/PYu-RC_Group_51_RoHS_L_12.pdf; ComponentLink1Description: PYu-RC_Group_51_RoHS_L_12.pdf; Original PN: RC0201FR-0722RL
R?#42 = RC2010FK-0710KL: Резисторы (chip) общего назначения; Part_ID: ATB-00048; Manufacturer: Yageo; Schematic_Part: R_min_val,R_min,R_val,R; Наименование: 2010-0.75W-10K-100ppm±1%; Value: 10k; Voltage: 200V; Power: 0.75; Точность: ±1%; ТКС (от  -60 до +20 град): ± 100; Ряд: E24; Температура: -55 +155; Вариант установки: Поверхностный; Код ERP: E2-00020426; Photo: Photos\Photos\Yageo_RC0075-RC2512.jpg; Автор: Чепиков И.В.; Device: 2010-0.75W-10K-100ppm±1%_Yageo; Library Ref 2: R; Part Number: RC2010FK-0710KL; Тип ЭКБ: Резисторы; Datasheet: Datasheets\Resistors\PYu-RC_Group_51_RoHS_L_12.pdf; Тип компонента: Резистор; Номинал: 10к; ТКС (от +20 град до max): ± 100; Part_Number: RC2010FK-0710KL; PCB_Footprint: resc5025x65n; Тип корпуса: Chip; Height: 0.65; Производитель: Yageo; Website: https://www.yageo.com/upload/media/product/products/datasheet/rchip/PYu-RC_Group_51_RoHS_L_12.pdf; Дата: 27.02.2024; NameFromManufacturer: RC2010FK-0710KL; ComponentLink1URL: https://www.yageo.com/upload/media/product/products/datasheet/rchip/PYu-RC_Group_51_RoHS_L_12.pdf; ComponentLink1Description: PYu-RC_Group_51_RoHS_L_12.pdf; Original PN: RC2010FK-0710KL
X?#9-X?#13 = SMARC: as X?#1 on sheet RK3576-SMC.SMARC_1 (0021.0 A0); Part Number: SMARC; Наименование: SMARC; Datasheet: Datasheets\Connectors\SMARC_V21-specification.pdf; Schematic_Part: SMARC_v2_1_XP; Value: SMARC; Part_Number: SMARC; PCB_Footprint: con_smarc; Website: https://www.isee.biz/images/Manuals/smarc/SMARC_Hardware_Specification_V211.pdf; Дата: 01.07.2024; Device: SMARC; NameFromManufacturer: SMARC; ComponentLink1URL: https://www.isee.biz/images/Manuals/smarc/SMARC_Hardware_Specification_V211.pdf; ComponentLink1Description: SMARC_V21-specification.pdf; Original PN: SMARC